# EAGLE schematic 4915 (EAGLE 6.6.0)
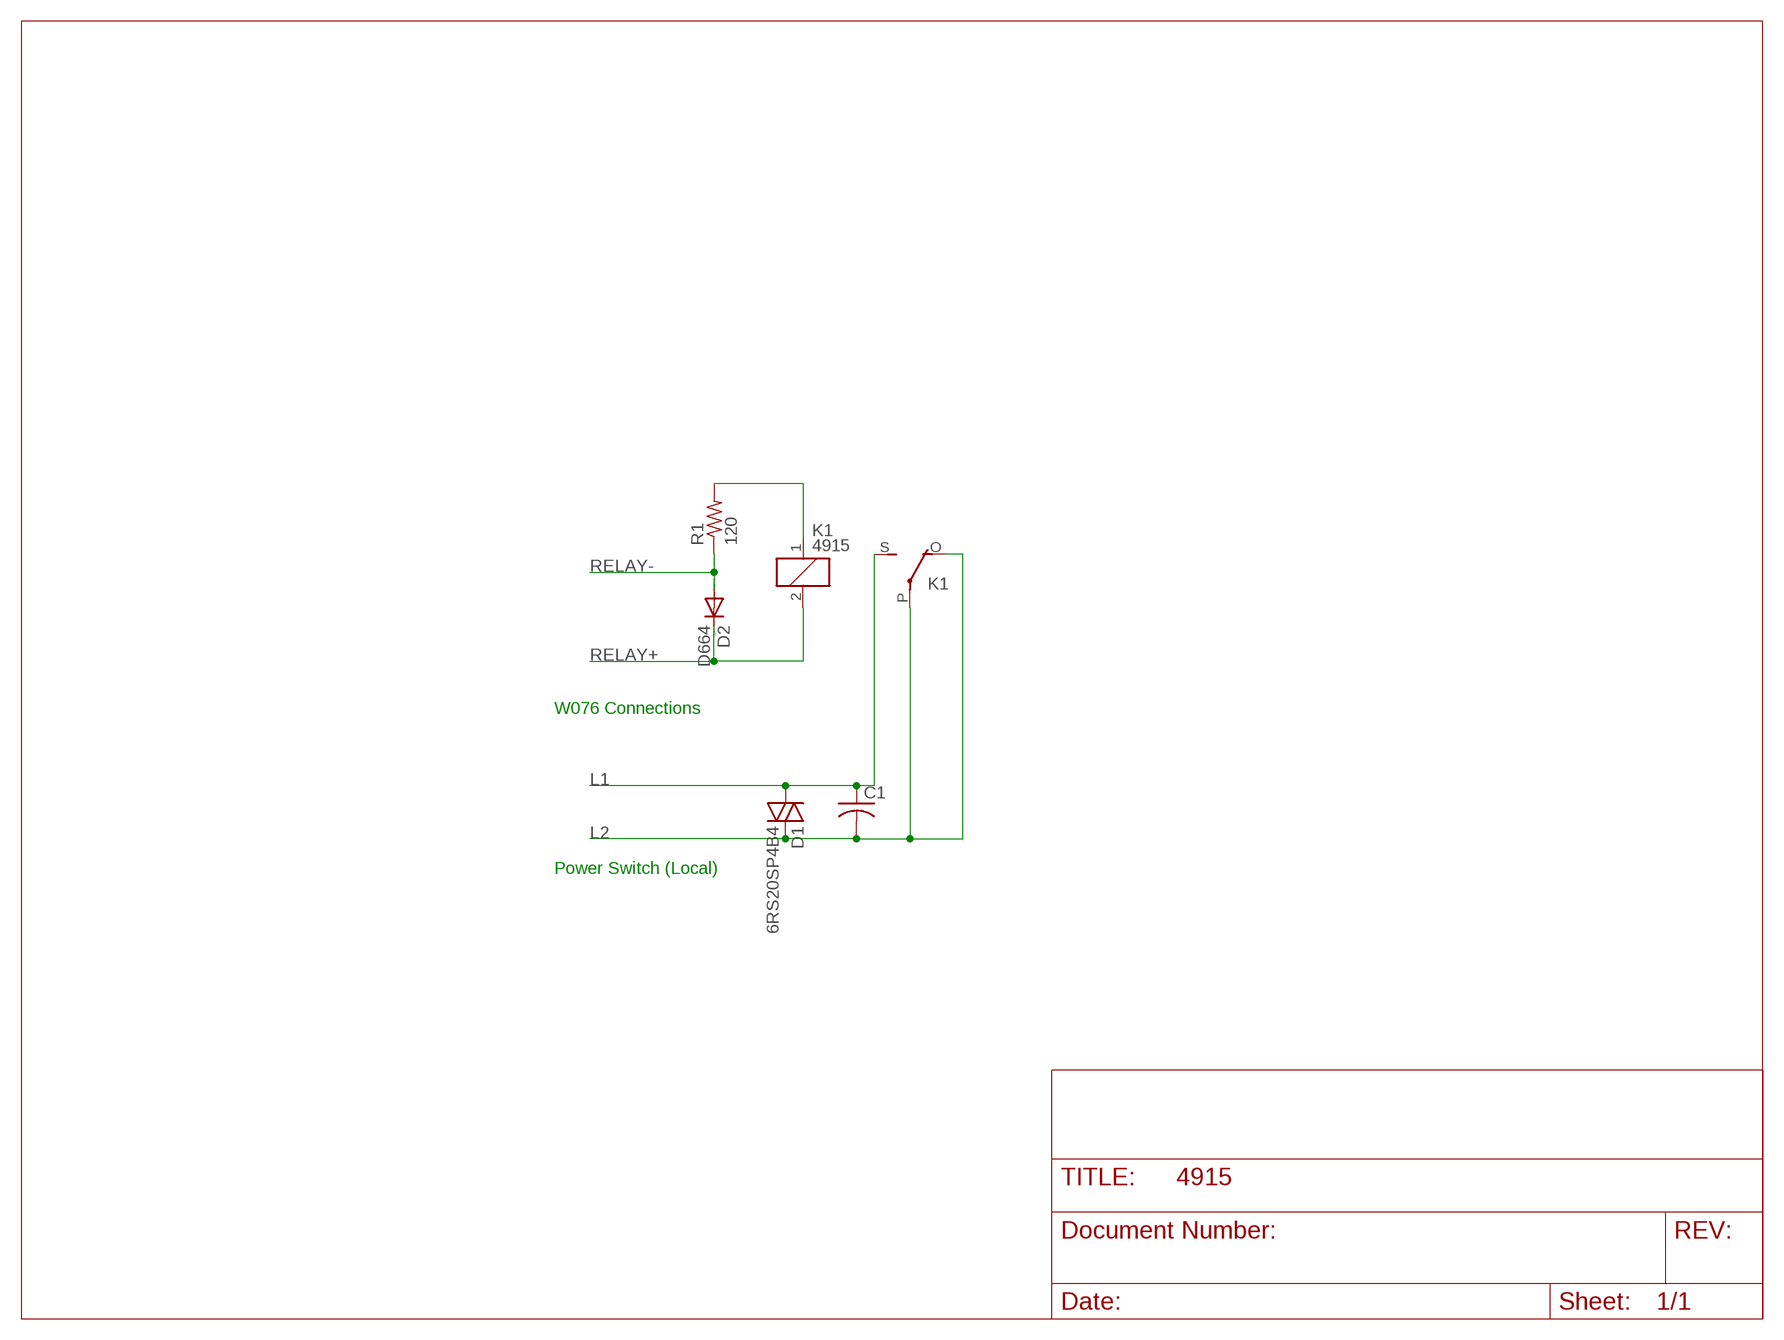
[diagram p0: schematic, sheet 1]

## Parts
C1  C-US050-025X075  [C050-025X075]
D1  6RS20SP4B4  DIAC-GT32  [GT32]
D2  D664  1N4148DO35-10  [DO35-10]
K1  4915  G6RW  [G6RW]
R1  120  R-US_0207/10  [0207/10]

## Nets
L1: C1.1 D1.1 K1.S(2:S)
L2: C1.2 D1.2 K1.O(2:O) K1.P(2:P)
N$2: K1.1 R1.2
RELAY+: D2.C K1.2
RELAY-: D2.A R1.1

## Notes on the sheet
- W076 Connections
- Power Switch (Local)

## Library data of the parts
C1 = rcl:C-US: CAPACITOR, American symbol
D1 = diode:DIAC-: DIAC
D2 = diode:1N4148: DIODE high speed (Philips)
K1 = relay:G6RW: RELAY 1 x switch, Omron; OC_FARNELL: unknown; OC_NEWARK: unknown
R1 = rcl:R-US_: RESISTOR, American symbol